# Altium schematic sheet TOP.SchDoc: Arduino Nano R4
size A3; Author: Arturo Guadalupi; Revision: V1.0; SheetNumber: 1; SheetTotal: 1; RevAuthor: Danilo Leo
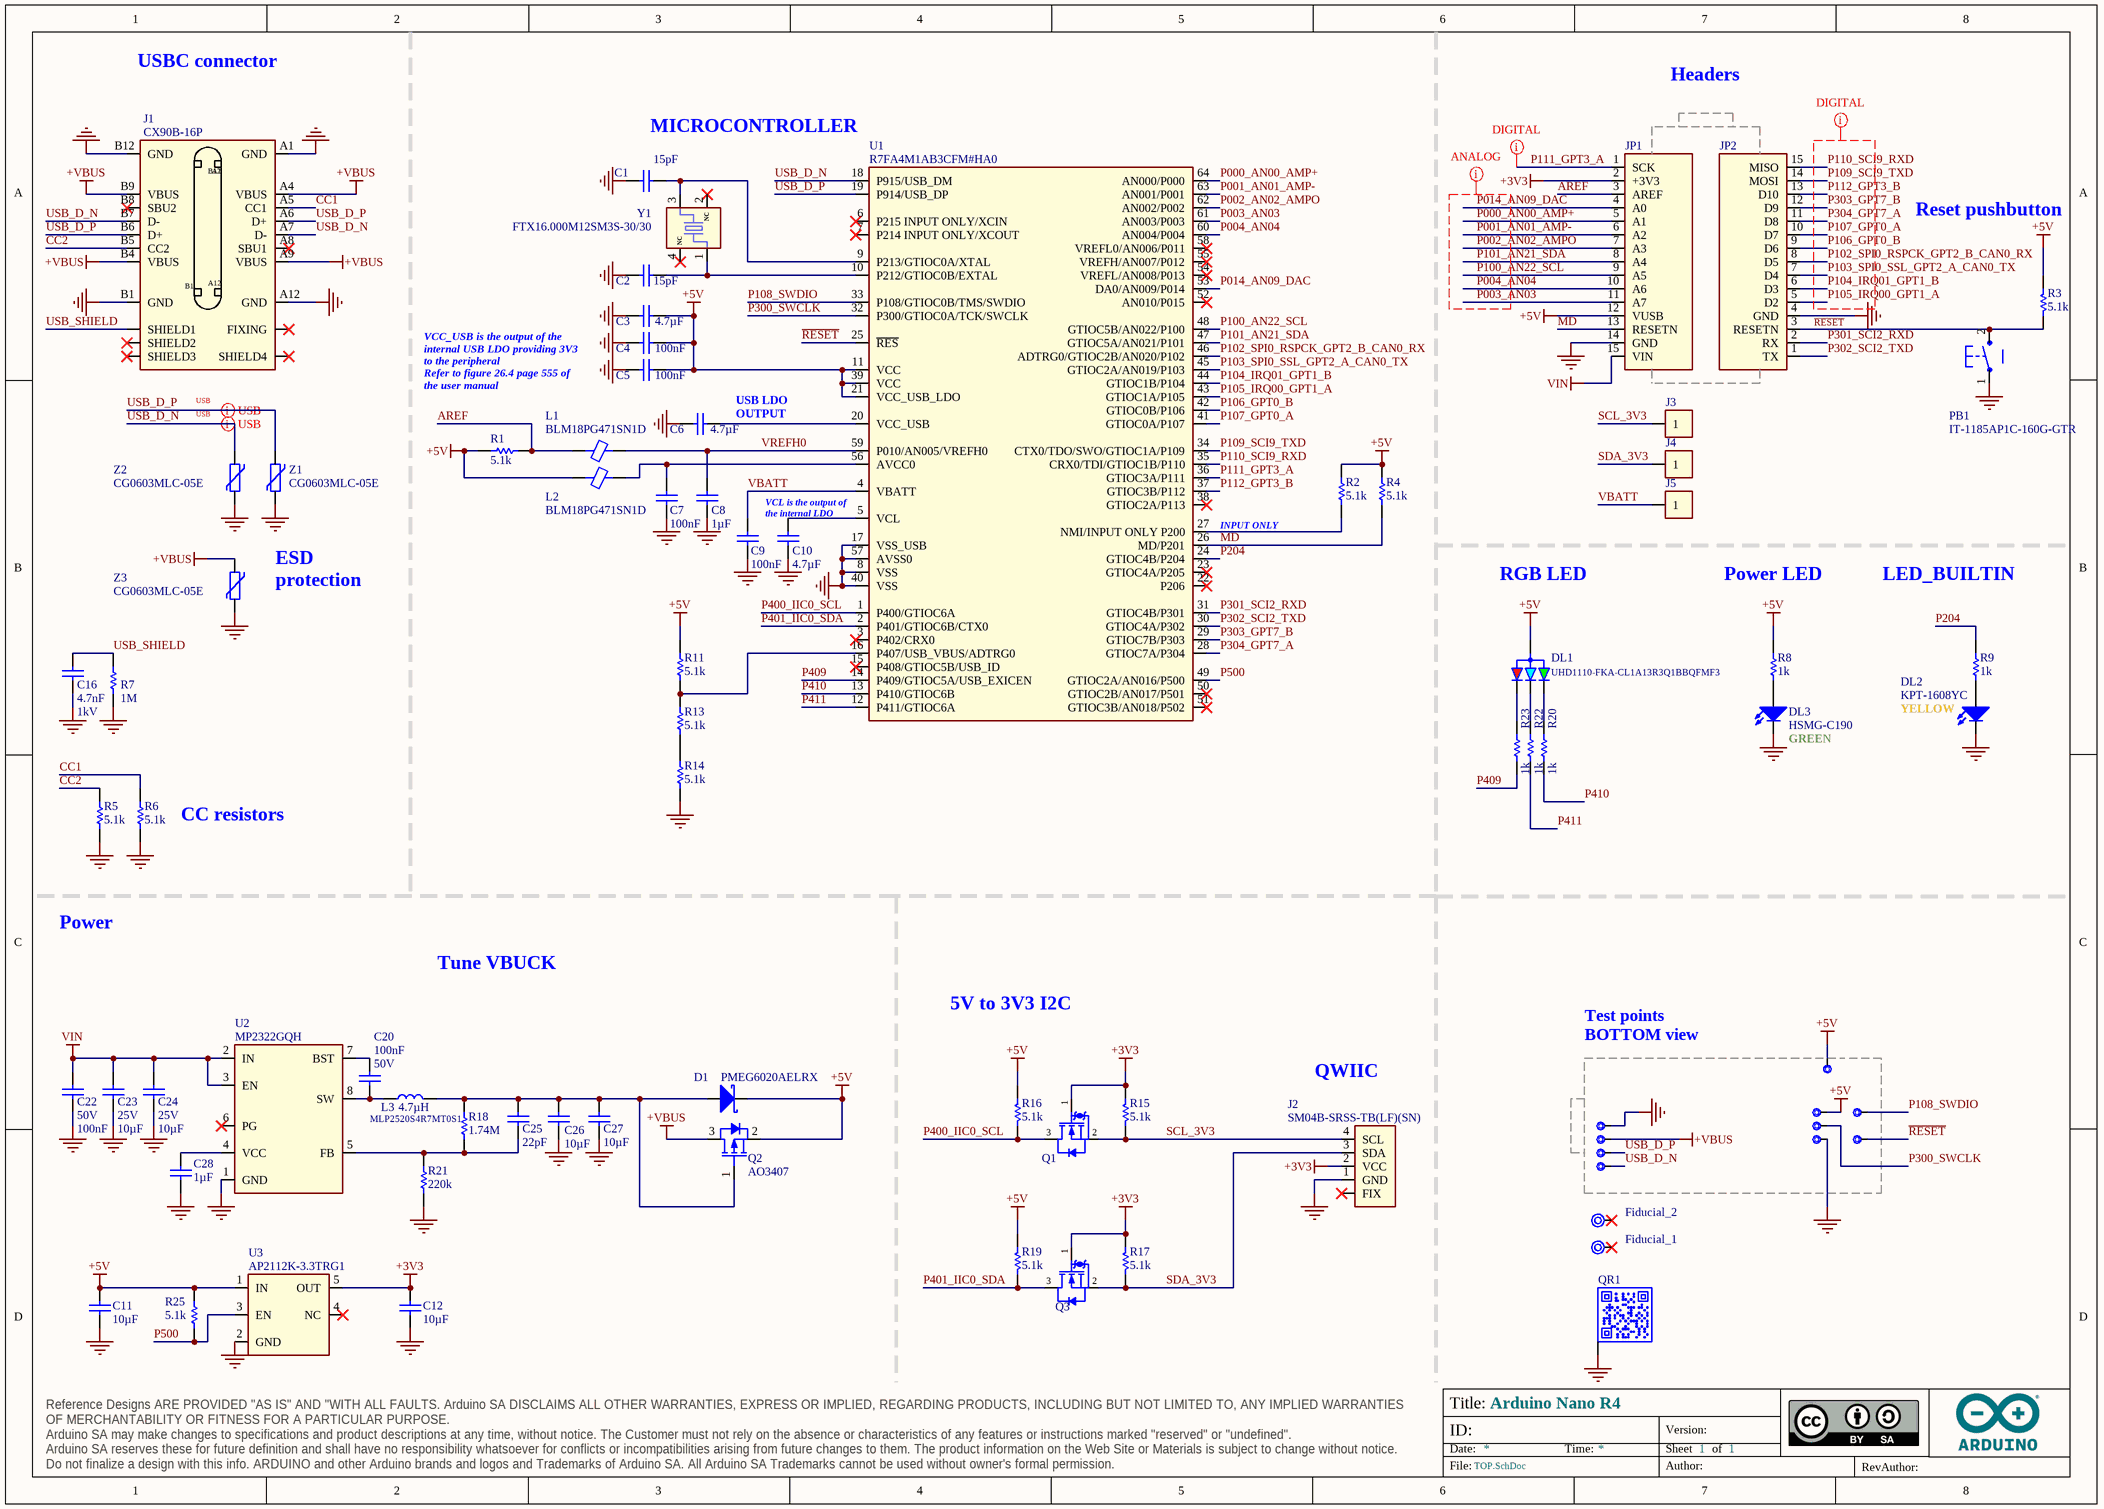
[diagram p0: TOP.SchDoc]

## Parts
3V3  Test point 1.00mm  [TP-1.00MM]  (value not drawn)  (no BOM)
C1  value 15pF  [CAP-0402]  (hidden comment: C0402C150J5GACTU)
C2  value 15pF  [CAP-0402]  (hidden comment: C0402C150J5GACTU)
C3  value 4.7µF  [CAP-0402]  (hidden comment: C1005A475M6R3NT)
C4  value 100nF  [CAP-0402]  (hidden comment: GRM155R61H104KE19D)
C5  value 100nF  [CAP-0402]  (hidden comment: GRM155R61H104KE19D)
C6  value 4.7µF  [CAP-0402]  (hidden comment: C1005A475M6R3NT)
C7  value 100nF  [CAP-0402]  (hidden comment: GRM155R61H104KE19D)
C8  value 1µF  [CAP-0402]  (hidden comment: CL05A105KP5NNNC)
C9  value 100nF  [CAP-0402]  (hidden comment: GRM155R61H104KE19D)
C10  value 4.7µF  [CAP-0402]  (hidden comment: C1005A475M6R3NT)
C11  value 10µF  [CAP-0603]  (hidden comment: GRM188R61A106KE69D)
C12  value 10µF  [CAP-0603]  (hidden comment: GRM188R61A106KE69D)
C16  value 4.7nF  Voltage: 1kV  [CAP-0805]  (hidden comment: FV21X472K102ECG)
C20  value 100nF  Voltage: 50V  [CAP-0402]  (hidden comment: GRM155R61H104KE19D)
C22  value 100nF  Voltage: 50V  [CAP-0402]  (hidden comment: GRM155R61H104KE19D)
C23  value 10µF  Voltage: 25V  [CAP-0603]  (hidden comment: C1608A106M250NT)
C24  value 10µF  Voltage: 25V  [CAP-0603]  (hidden comment: C1608A106M250NT)
C25  value 22pF  [CAP-0402]  (hidden comment: 0402N220J500CT)
C26  value 10µF  [CAP-0603]  (hidden comment: C1608A106M250NT)
C27  value 10µF  [CAP-0603]  (hidden comment: C1608A106M250NT)
C28  value 1µF  [CAP-0402]  (hidden comment: C1005X5R1E105K050BC)
D1  PMEG6020AELRX  [SOD123-1]
D+1  Test point 1.00mm  [TP-1.00MM]  (value not drawn)  (no BOM)
D-1  Test point 1.00mm  [TP-1.00MM]  (value not drawn)  (no BOM)
DL1  UHD1110-FKA-CL1A13R3Q1BBQFMF3  [UHD1110-FKA-CL1A13R3Q1BBQFMF3]
DL2  KPT-1608YC  [LEDC1608X80N-AK]
DL3  HSMG-C190  [LEDC1608X80N-AK]
Fiducial_1  Fiducial mark 1mm with 2mm solder  [Fiducial mark 1mm with circle-Footprint-1]  (value not drawn)  (no BOM)
Fiducial_2  Fiducial mark 1mm with 2mm solder  [Fiducial mark 1mm with circle-Footprint-1]  (value not drawn)  (no BOM)
GND1  Test point 1.00mm  [TP-1.00MM]  (value not drawn)  (no BOM)
GND2  Test point 1.00mm  [TP-1.00MM]  (value not drawn)  (no BOM)
GPIO46  Test point 1.00mm  [TP-1.00MM]  (value not drawn)  (no BOM)
J1  CX90B-16P  [CX90B-16P-Footprint-1]
J2  SM04B-SRSS-TB(LF)(SN)  [SM04B-SRSS-TB(LF)(SN)-Footprint-1]
J3  HEADER TH 2.54mm VERT. 1x001POS  [PIN HEADER 2.54mm VERT. 1x1POS]  (value not drawn)  (no BOM)
J4  HEADER TH 2.54mm VERT. 1x001POS  [PIN HEADER 2.54mm VERT. 1x1POS]  (value not drawn)  (no BOM)
J5  HEADER TH 2.54mm VERT. 1x001POS  [PIN HEADER 2.54mm VERT. 1x1POS]  (value not drawn)  (no BOM)
JP1  PINHD-1X15-NANO-ANALOG-CASTELLATED  [PINHD-1X14_5VF]  (value not drawn)
JP2  PINHD-1X15-NANO-DIGITAL-CASTELLATED  [PINHD-1X14_5VF]  (value not drawn)
L1  BLM18PG471SN1D  [L-0603]
L2  BLM18PG471SN1D  [L-0603]
L3  MLP2520S4R7MT0S1  value 4.7µH  [INDC2520X10L]
NC1  Test point 1.00mm  [TP-1.00MM]  (value not drawn)  (no BOM)
NC2  Test point 1.00mm  [TP-1.00MM]  (value not drawn)  (no BOM)
PB1  IT-1185AP1C-160G-GTR  [C&K_PTS820_NO_HOLES-1]
Q1  2N7002KT1G  [SOT23]  (value not drawn)
Q2  AO3407  [SOT23-3]
Q3  2N7002KT1G  [SOT23]  (value not drawn)
QR1  QR CODE 4x4mm  [QR CODE 4x4mm]  (value not drawn)  (no BOM)
R1  value 5.1k  [RES-0402]  (hidden comment: RC0402FR-075K1L)
R2  value 5.1k  [RES-0402]  (hidden comment: RC0402FR-075K1L)
R3  value 5.1k  [RES-0402]  (hidden comment: RC0402FR-075K1L)
R4  value 5.1k  [RES-0402]  (hidden comment: RC0402FR-075K1L)
R5  value 5.1k  [RES-0402]  (hidden comment: RC0402FR-075K1L)
R6  value 5.1k  [RES-0402]  (hidden comment: RC0402FR-075K1L)
R7  value 1M  [RES-0402]  (hidden comment: CRCW04021M00FKED)
R8  value 1k  [RES-0402]  (hidden comment: CRCW04021K00FKEDC)
R9  value 1k  [RES-0402]  (hidden comment: CRCW04021K00FKEDC)
R11  value 5.1k  [RES-0402]  (hidden comment: RC0402FR-075K1L)
R13  value 5.1k  [RES-0402]  (hidden comment: RC0402FR-075K1L)
R14  value 5.1k  [RES-0402]  (hidden comment: RC0402FR-075K1L)
R15  value 5.1k  [RES-0402]  (hidden comment: RC0402FR-075K1L)
R16  value 5.1k  [RES-0402]  (hidden comment: RC0402FR-075K1L)
R17  value 5.1k  [RES-0402]  (hidden comment: RC0402FR-075K1L)
R18  value 1.74M  [RES-0402]  (hidden comment: RC0402FR-071M74L)
R19  value 5.1k  [RES-0402]  (hidden comment: RC0402FR-075K1L)
R20  value 1k  [RES-0402]  (hidden comment: CRCW04021K00FKEDC)
R21  value 220k  [RES-0402]  (hidden comment: CRCW0402220KFKED)
R22  value 1k  [RES-0402]  (hidden comment: CRCW04021K00FKEDC)
R23  value 1k  [RES-0402]  (hidden comment: CRCW04021K00FKEDC)
R25  value 5.1k  [RES-0402]  (hidden comment: RC0402FR-075K1L)
TP_VUSB  Test point 1.00mm  [TP-1.00MM]  (value not drawn)  (no BOM)
U1  R7FA4M1AB3CFM#HA0  [CQFP50P1200X1200X170-64L]
U2  MP2322GQH  [QFN50P150X200X90-8L]
U3  AP2112K-3.3TRG1  [SOT25]
VUSB  Test point 1.00mm  [TP-1.00MM]  (value not drawn)  (no BOM)
Y1  FTX16.000M12SM3S-30/30  [CRYSTAL_3.2x2.5mm_16MHz]
Z1  CG0603MLC-05E  [0603]
Z2  CG0603MLC-05E  [0603]
Z3  CG0603MLC-05E  [0603]

## Nets
+3V3: C12.2 J2.2(VCC) JP1.2(+3V3) Q1.1(G) Q3.1(G) R15.1 R17.1 U3.5(OUT)
+5V: 3V3.X C3.2 C4.2 C5.2 C11.2 D1.C DL1.4(ANODE) JP1.12(VUSB) L2.1 Q2.2(S) R1.2 R2.1 R3.2 R4.1 R8.2 R11.2 R16.1 R19.1 R25.2 U1.11(VCC) U1.21(VCC_USB_LDO) U1.39(VCC) U3.1(IN) VUSB.X
+VBUS: J1.A4(VBUS) J1.A9(VBUS) J1.B4(VBUS) J1.B9(VBUS) Q2.3(D) TP_VUSB.X Z3.1
GND: C1.2 C2.2 C3.1 C4.1 C5.1 C6.1 C7.1 C8.2 C9.1 C10.1 C11.1 C12.1 C16.1 C22.2 C23.1 C24.1 C26.1 C27.1 C28.1 DL2.C DL3.C GND1.X GND2.X J1.A1(GND) J1.A12(GND) J1.B1(GND) J1.B12(GND) J2.1(GND) JP1.14(GND) JP2.4(GND) PB1.1 QR1.PAD R5.1 R6.1 R7.1 R14.1 R21.1 U1.8(VSS) U1.17(VSS_USB) U1.40(VSS) U1.57(AVSS0) U2.1(GND) U3.2(GND) Z1.2 Z2.2 Z3.2
VIN: C22.1 C23.2 C24.2 JP1.15(VIN) U2.2(IN) U2.3(EN)
AREF: JP1.3(AREF) L1.1 R1.1
CC1: J1.A5(CC1) R6.2
CC2: J1.B5(CC2) R5.2
MD: JP1.13(RESETN) R4.2 U1.26(MD/P201)
P000_AN00_AMP+: JP1.5(A1) U1.64(AN000/P000)
P001_AN01_AMP-: JP1.6(A2) U1.63(AN001/P001)
P002_AN02_AMPO: JP1.7(A3) U1.62(AN002/P002)
P003_AN03: JP1.11(A7) U1.61(AN003/P003)
P004_AN04: JP1.10(A6) U1.60(AN004/P004)
P014_AN09_DAC: JP1.4(A0) U1.53(DA0/AN009/P014)
P100_AN22_SCL: JP1.9(A5) U1.48(GTIOC5B/AN022/P100)
P101_AN21_SDA: JP1.8(A4) U1.47(GTIOC5A/AN021/P101)
P102_SPI0_RSPCK_GPT2_B_CAN0_RX: JP2.8(D5) U1.46(ADTRG0/GTIOC2B/AN020/P102)
P103_SPI0_SSL_GPT2_A_CAN0_TX: JP2.7(D4) U1.45(GTIOC2A/AN019/P103)
P104_IRQ01_GPT1_B: JP2.6(D3) U1.44(GTIOC1B/P104)
P105_IRQ00_GPT1_A: JP2.5(D2) U1.43(GTIOC1A/P105)
P106_GPT0_B: JP2.9(D6) U1.42(GTIOC0B/P106)
P107_GPT0_A: JP2.10(D7) U1.41(GTIOC0A/P107)
P108_SWDIO: NC1.X U1.33(P108/GTIOC0B/TMS/SWDIO)
P109_SCI9_TXD: JP2.14(MOSI) U1.34(CTX0/TDO/SWO/GTIOC1A/P109)
P110_SCI9_RXD: JP2.15(MISO) U1.35(CRX0/TDI/GTIOC1B/P110)
P111_GPT3_A: JP1.1(SCK) U1.36(GTIOC3A/P111)
P112_GPT3_B: JP2.13(D10) U1.37(GTIOC3B/P112)
P204: R9.2 U1.24(GTIOC4B/P204)
P300_SWCLK: GPIO46.X U1.32(P300/GTIOC0A/TCK/SWCLK)
P301_SCI2_RXD: JP2.2(RX) U1.31(GTIOC4B/P301)
P302_SCI2_TXD: JP2.1(TX) U1.30(GTIOC4A/P302)
P303_GPT7_B: JP2.12(D9) U1.29(GTIOC7B/P303)
P304_GPT7_A: JP2.11(D8) U1.28(GTIOC7A/P304)
P400_IIC0_SCL: Q1.3(D) R16.2 U1.1(P400/GTIOC6A)
P401_IIC0_SDA: Q3.3(D) R19.2 U1.2(P401/GTIOC6B/CTX0)
P409: R23.1 U1.14(P409/GTIOC5A/USB_EXICEN)
P410: R20.1 U1.13(P410/GTIOC6B)
P411: R22.1 U1.12(P411/GTIOC6A)
P500: R25.1 U1.49(GTIOC2A/AN016/P500) U3.3(EN)
~{RESET}: JP2.3(RESETN) NC2.X PB1.2 R3.1 U1.25(~{RES})
SCL_3V3: J2.4(SCL) J3.1 Q1.2(S) R15.2
SDA_3V3: J2.3(SDA) J4.1 Q3.2(S) R17.2
USB_D_N: D-1.X J1.A7(D-) J1.B7(D-) U1.18(P915/USB_DM) Z2.1
USB_D_P: D+1.X J1.A6(D+) J1.B6(D+) U1.19(P914/USB_DP) Z1.1
USB_SHIELD: C16.2 J1.SHIELD1 R7.2
VBATT: C9.2 J5.1 U1.4(VBATT)
VREFH0: C8.1 L1.2 U1.59(P010/AN005/VREFH0)
NetC1_1: C1.1 U1.9(P213/GTIOC0A/XTAL) Y1.3
NetC2_1: C2.1 U1.10(P212/GTIOC0B/EXTAL) Y1.1
NetC6_2: C6.2 U1.20(VCC_USB)
NetC7_2: C7.2 L2.2 U1.56(AVCC0)
NetC10_2: C10.2 U1.5(VCL)
NetC20_1: C20.1 L3.1 U2.8(SW)
NetC20_2: C20.2 U2.7(BST)
NetC25_1: C25.1 R18.1 R21.2 U2.5(FB)
NetC25_2: C25.2 C26.2 C27.2 D1.A L3.2 Q2.1(G) R18.2
NetC28_2: C28.2 U2.4(VCC)
NetDL1_1: DL1.1(BLUE_C) R22.2
NetDL1_2: DL1.2(GREEN_C) R20.2
NetDL1_3: DL1.3(RED_C) R23.2
NetDL2_A: DL2.A R9.1
NetDL3_A: DL3.A R8.1
NetR2_2: R2.2 U1.27(NMI/INPUT_ONLY_P200)
NetR11_1: R11.1 R13.2 U1.16(P407/USB_VBUS/ADTRG0)
NetR13_1: R13.1 R14.2

Not connected (* = marked no-connect by the designer): Fiducial_1 1*; Fiducial_2 1*; J1 A8(SBU1)* B8(SBU2)* FIXING* SHIELD2* SHIELD3* SHIELD4*; J2 FIX*; U1 3(P402/CRX0)* 6(P215_INPUT_ONLY/XCIN)* 7(P214_INPUT_ONLY/XCOUT)* 15(P408/GTIOC5B/USB_ID)* 22(P206)* 23(GTIOC4A/P205)* 38(GTIOC2A/P113)* 50(GTIOC2B/AN017/P501)* 51(GTIOC3B/AN018/P502)* 52(AN010/P015)* 54(VREFL/AN008/P013)* 55(VREFH/AN007/P012)* 58(VREFL0/AN006/P011)*; U2 6(PG)*; U3 4(NC)*; Y1 2(NC)* 4(NC)*

## Layout directives
net class ANALOG: P000_AN00_AMP+, P001_AN01_AMP-, P002_AN02_AMPO, P003_AN03, P004_AN04, P014_AN09_DAC, P100_AN22_SCL, P101_AN21_SDA
net class DIGITAL: P102_SPI0_RSPCK_GPT2_B_CAN0_RX, P103_SPI0_SSL_GPT2_A_CAN0_TX, P104_IRQ01_GPT1_B, P105_IRQ00_GPT1_A, P106_GPT0_B, P107_GPT0_A, P109_SCI9_TXD, P110_SCI9_RXD, P111_GPT3_A, P112_GPT3_B, P303_GPT7_B, P304_GPT7_A
differential pair; differential pair class USB: USB_D_N, USB_D_P

## Notes on the sheet
- USBC connector
- Headers
- MICROCONTROLLER
- Reset pushbutton
- VCC_USB is the output of the internal USB LDO providing 3V3 to the peripheral
  Refer to figure 26.4 page 555 of the user manual
- (near C6) USB LDO OUTPUT
- VCL is the output of the internal LDO
- INPUT ONLY
- RGB LED
- Power LED
- LED_BUILTIN
- ESD
  protection
- YELLOW
- (near DL3) GREEN
- (near R6) CC resistors
- Power
- Tune VBUCK
- 5V to 3V3 I2C translators
- Test points BOTTOM view
- QWIIC
- Title:
- ID:
- Date:
- Time:
- Version:
- Sheet
- of
- RevAuthor:
- Reference Designs ARE PROVIDED "AS IS" AND "WITH ALL FAULTS. Arduino SA DISCLAIMS ALL OTHER WARRANTIES, EXPRESS OR IMPLIED, REGARDING PRODUCTS, INCLUDING BUT NOT LIMITED TO, ANY IMPLIED WARRANTIES OF MERCHANTABILITY OR FITNESS FOR A PARTICULAR PURPOSE.
  Arduino SA may make changes to specifications and product descriptions at any time, without notice. The Customer must not rely on the absence or characteristics of any features or instructions marked "reserved" or "undefined".
  Arduino SA reserves these for future definition and shall have no responsibility whatsoever for conflicts or incompatibilities arising from future changes to them. The product information on the Web Site or Materials is subject to change without notice.
  Do not finalize a design with this info. ARDUINO and other Arduino brands and logos and Trademarks of Arduino SA. All Arduino SA Trademarks cannot be used without owner's formal permission.
- File:
- Author:

## Library data of the parts
3V3 D+1 D-1 GND1 GND2 GPIO46 NC1 NC2 TP_VUSB VUSB = UT0013-A.6: Manufacturer: This is not a component; Source: ut.SchLib; Design Item ID: CMP-018-0005-A.3; Pin Count: 1; Part Number: This is not a component; Code Arduino: This is not a component
C1 C2 = C0025-A.16: CAP CHIP 0402 15pF 5% 50V C0G; Manufacturer: KEMET; Code Arduino: A5498; Part Number: C0402C150J5GACTU; Case Code (Imperial): 0402; Dielectric: C0G; Tolerance: 5%; Voltage: 50V; Technology: Ceramic
C3 C6 C10 = C0037-A.14: CAP CHIP 0402 4.7uF 20% 6V3 X5R; Manufacturer: Hottech; Voltage: 6.3V; Code Arduino: 0833; Tolerance: 20%; Case Code (Imperial): 0402; Manufacturer 2: Samsung Electro-Mechanics; Part Number: C1005A475M6R3NT; Dielectric: X5R; Technology: Ceramic; Part number 3: GRM155R60J475ME47D; Part number 2: CL05A475KQ5NRNC; Manufacturer 3: Murata Electronics
C4 C5 C7 C9 C20 C22 = C0015-A.14: CAP CHIP 0402 100nF 10% 50V X5R; Manufacturer: Murata; Code Arduino: A5141; Tolerance: 10%; Case Code (Imperial): 0402; Dielectric: X5R; Part Number: GRM155R61H104KE19D; Technology: Ceramic
  C4 C5 C7 C9: Voltage: 50V
C8 = C0017-A.14: CAP CHIP 0402 1uF 10% 10V X5R; Manufacturer: Samsung Electro-Mechanics; Code Arduino: 0133; Manufacturer 2: Murata Electronics; Tolerance: 10%; Part Number: CL05A105KP5NNNC; Dielectric: X5R; Voltage: 10V; Case Code (Imperial): 0402; Technology: Ceramic; Part number 2: GCM155C71A105KE38D
C11 C12 = C0163-A.1: CAP CHIP 0603 10uF 10% 10V X5R; Manufacturer: Murata; Code Arduino: C0163; Technology: SMD; Voltage: 10V; Dielectric: X5R; Part Number: GRM188R61A106KE69D; Case Code (Imperial): 0603; Tolerance: 10%
C16 = C0059-A.14: CAP CHIP 0805 4.7nF 10% 1000V X7R; Manufacturer: PSA Shenzen; Code Arduino: 0689; Manufacturer 2: KEMET; Tolerance: 10%; Case Code (Imperial): 0805; Part Number: FV21X472K102ECG; Dielectric: X7R; Part number 2: C0805V472KDRACTU; Part number 3: C0805C472KDRACTU; Manufacturer 3: KEMET; Technology: Ceramic
C23 C24 C26 C27 = C0047-A.18: CAP CHIP 0603 10uF 20% 25V X5R; Manufacturer: Hottech; Code Arduino: 2213; Manufacturer 2: Murata Electronics; Part Number: C1608A106M250NT; Dielectric: X5R; Tolerance: 20%; Case Code (Imperial): 0603; Part number 2: CL10A106MA8NRNC; Technology: Ceramic
  C26 C27: Voltage: 25V
C25 = C0029-A.14: CAP CHIP 0402 22pF 5% 50V C0G; Manufacturer: Walsin; Code Arduino: 0137; Case Code (Imperial): 0402; Tolerance: 5%; Part Number: 0402N220J500CT; Manufacturer 2: Murata Electronics; Voltage: 50V; Dielectric: C0G; Part number 3: C0402C220K5GAC7867; Part number 2: GRM1555C1H220JA01D; Manufacturer 3: KEMET; Technology: Ceramic
C28 = C0177-A.1: CAP CHIP 0402 1uF 10% 50V X5R; Manufacturer: TDK; Code Arduino: C0177; Voltage: 25V; Tolerance: 10%; Part Number: C1005X5R1E105K050BC; Dielectric: X5R; Case Code (Imperial): 0402; Technology: Ceramic
D1 = D0026-A.6: DIODE SCHOTTKY SMD 2A 60V SOD123FL; Manufacturer: Nexperia; Manucturer Part Number 2: SS26L; Code Arduino: 2208; Manucturer 2: Hottech; Forward Voltage: 0.6V; Part Number: PMEG6020AELRX; Device Type: Diode Schottky; Forward Current: 2A; RoHS Compliance: RoHS3
DL1 = L0026-A.4: LED RGB BLACK BODY SMD; Manufacturer: Cree LED; Code Arduino: L0026; Pin Count: 4; Part Number: UHD1110-FKA-CL1A13R3Q1BBQFMF3
DL2 = L0008-A.5: LED SMD 0603 GIA588   8mcd 120^; Manufacturer: Kingbright; Code Arduino: 2243; Part Number: KPT-1608YC; Pin Count: 2
DL3 = L0009-A.5: LED SMD 0603 GREEN/568 15mcd 120^; Manufacturer: Broadcom; Code Arduino: 2204; Part Number: HSMG-C190; Pin Count: 2
Fiducial_1 Fiducial_2 = UT0024-A.6
J1 = J0272-A.3: CONN RCPT USB3.1 TYPEC 16POS SMD; Manufacturer: Hirose; Code Arduino: J0272; Part Number: CX90B-16P
J2 = J0005-A.2: CONN JST 4POS SIDE 1MM TIN QWIIC; Code Arduino: J0005; Part Number: SM04B-SRSS-TB(LF)(SN); Manufacturer: JST
J3-J5 = J0176-A.7: Code Arduino: J0176
JP1 = J0158-A.4: CONN THD SOCKET F/1/D 15V JANALOG NANO-TYPE CASTELLATED; Code Arduino: 0646; Pin Count: 15
JP2 = J0183-A.4: CONN THD SOCKET F/1/D 15V JDIGITAL NANO-TYPE CASTELLATED; Code Arduino: 0646; Pin Count: 15
L1 L2 = I0006-A.7: FERRITE SMD 0603 470R 1A 0.2R; Manufacturer: Murata; Test Frequency: 100MHz; Code Arduino: 2200; Tolerance: 25%; DC Resistance (DCR): 200mR; Part Number: BLM18PG471SN1D; Case Code (Imperial): 0603; Max DC Current: 1A; Min Operating Temperature: -55°C; Case Code (Metric): 1608; Package Quantity: 1; Current: 1A; Device Type: Ferrite; Max Operating Temperature: 125°C; Packaging: Tape and Reel
L3 = I0027-A.7: IND FIXED SMD 4.7UH 1A 130mOHM; Manufacturer: TDK; DC Resistance (DCR): 169mR; Tolerance: 20%; Test Frequency: 2MHz; Code Arduino: I0027; Package Quantity: 3000; Case Code (Metric): 2520; Max Operating Temperature: 125°C; Device Type: Inductor; Packaging: Tape and Reel; Inductance: 4.7µH; Min Operating Temperature: -40°C; Part Number: MLP2520S4R7MT0S1; Case Code (Imperial): 1008; Current: 1A
PB1 = B0001-A.7: PUSHBUTTON WHITE NO ANCHORS; Manufacturer: Switronic; Code Arduino: 0173; Color: White; Mount: SMT; Part Number: IT-1185AP1C-160G-GTR
Q1 Q3 = T0004-A.10: MOSFET N-CH 60V 300mA ESD prot. SOT23; Manufacturer: On Semiconductor; Device Type: Mosfet N-CH SMD; Code Arduino: A5393; Manufacturer Part Number 2: 2N7002K; Part Number: 2N7002KT1G; Pin Count: 3; Manufacturer 2: Hottech
Q2 = T0056-1: MOSFET P-CH 30V 3.5A SOT23 VGSmin=1.4-2.4V RDSon max 87mOhm (-4.5V); Manufacturer: Hottech; Code Arduino: T0056; Part Number: AO3407
QR1 = QR-0001-A.3: QR CODE 4x4mm on layer 34 (This is not a component); Code Arduino: QRCODE_4x4mm; Part Number: This is not a component; Manufacturer: This is not a component
R1 R2 R4-R6 R15-R17 R19 = R0210-A.19: RES CHIP 0402 5k1 1% 1/16W; Manufacturer: YAGEO; Power: 62.5mW; Code Arduino: R0210; Temperature coefficient: 100ppm; Tolerance: 1%; Part Number: RC0402FR-075K1L; Case Code (Imperial): 0402; Technology: Thick film
R3 R11 R13 R14 R25 = R0210-A.19: RES CHIP 0402 5k1 1% 1/16W; Manufacturer: YAGEO; Code Arduino: R0210; Power: 62.5mW; Temperature coefficient: 100ppm; Part Number: RC0402FR-075K1L; Tolerance: 1%; Case Code (Imperial): 0402; Technology: Thick film
R7 = R0058-A.24: RES CHIP 0402 1M 1% 1/16W; Manufacturer: Vishay; Power: 62.5mW; Code Arduino: 0139; Temperature coefficient: 100ppm; Case Code (Imperial): 0402; Tolerance: 1%; Part Number: CRCW04021M00FKED; Technology: Thick film
R8 R9 R20 R22 R23 = R0007-A.24: RES CHIP 0402 1k 1% 1/16W; Manufacturer: Vishay; Code Arduino: 0140; Power: 62.5mW; Temperature coefficient: 100ppm; Part Number: CRCW04021K00FKEDC; Tolerance: 1%; Case Code (Imperial): 0402; Technology: Thick film
R18 = R0367-A.1: RES CHIP 0402 1.74M 1% 1/16W; Manufacturer: YAGEO; Temperature coefficient: 100ppm; Power: 62.5mW; Code Arduino: R0367; Technology: Thick film; Tolerance: 1%; Part Number: RC0402FR-071M74L; Case Code (Imperial): 0402
R21 = R0028-A.24: RES CHIP 0402 220k 1% 1/16W; Manufacturer: Vishay; Code Arduino: 2334; Power: 62.5mW; Temperature coefficient: 200ppm; Part Number: CRCW0402220KFKED; Case Code (Imperial): 0402; Tolerance: 1%; Technology: Thick film
U1 = U0274-A.8: IC uC RA4M1 32b M4 48MHz 254KB flash 32KB RAM 105°C LQFP64 10x10mm; Manufacturer: Renesas; Code Arduino: U0274; Part Number: R7FA4M1AB3CFM#HA0
U2 = U0072-A.8: IC STEP DOWN CONV 1A 22V QFN8; Manufacturer: Monolithic Power Systems; Code Arduino: U0072; Part Number: MP2322GQH
U3 = U0027-A.11: IC LDO Vin max 6.5V Vout 3V3 Iout 600mA +EN  SOT25; Manufacturer: Diodes Inc; Code Arduino: 2199; Part Number: AP2112K-3.3TRG1
Y1 = X0019-A.12: CRYSTAL 16.0000MHz 12pF SMD; Manufacturer: Fronter Electronics; Code Arduino: 0395; Frequency: 16MHz; Part Number: FTX16.000M12SM3S-30/30
Z1-Z3 = P0007-A.3: VARISTOR SMD 0603 VDC 5V ESD PROTECTION; Manufacturer: Bourns; Code Arduino: 0010; Part Number: CG0603MLC-05E; Device Type: Varistor; Voltage: 5V